# Altium schematic sheet 主板_3.SchDoc
size A4; SheetNumber: 3; SheetTotal: 3
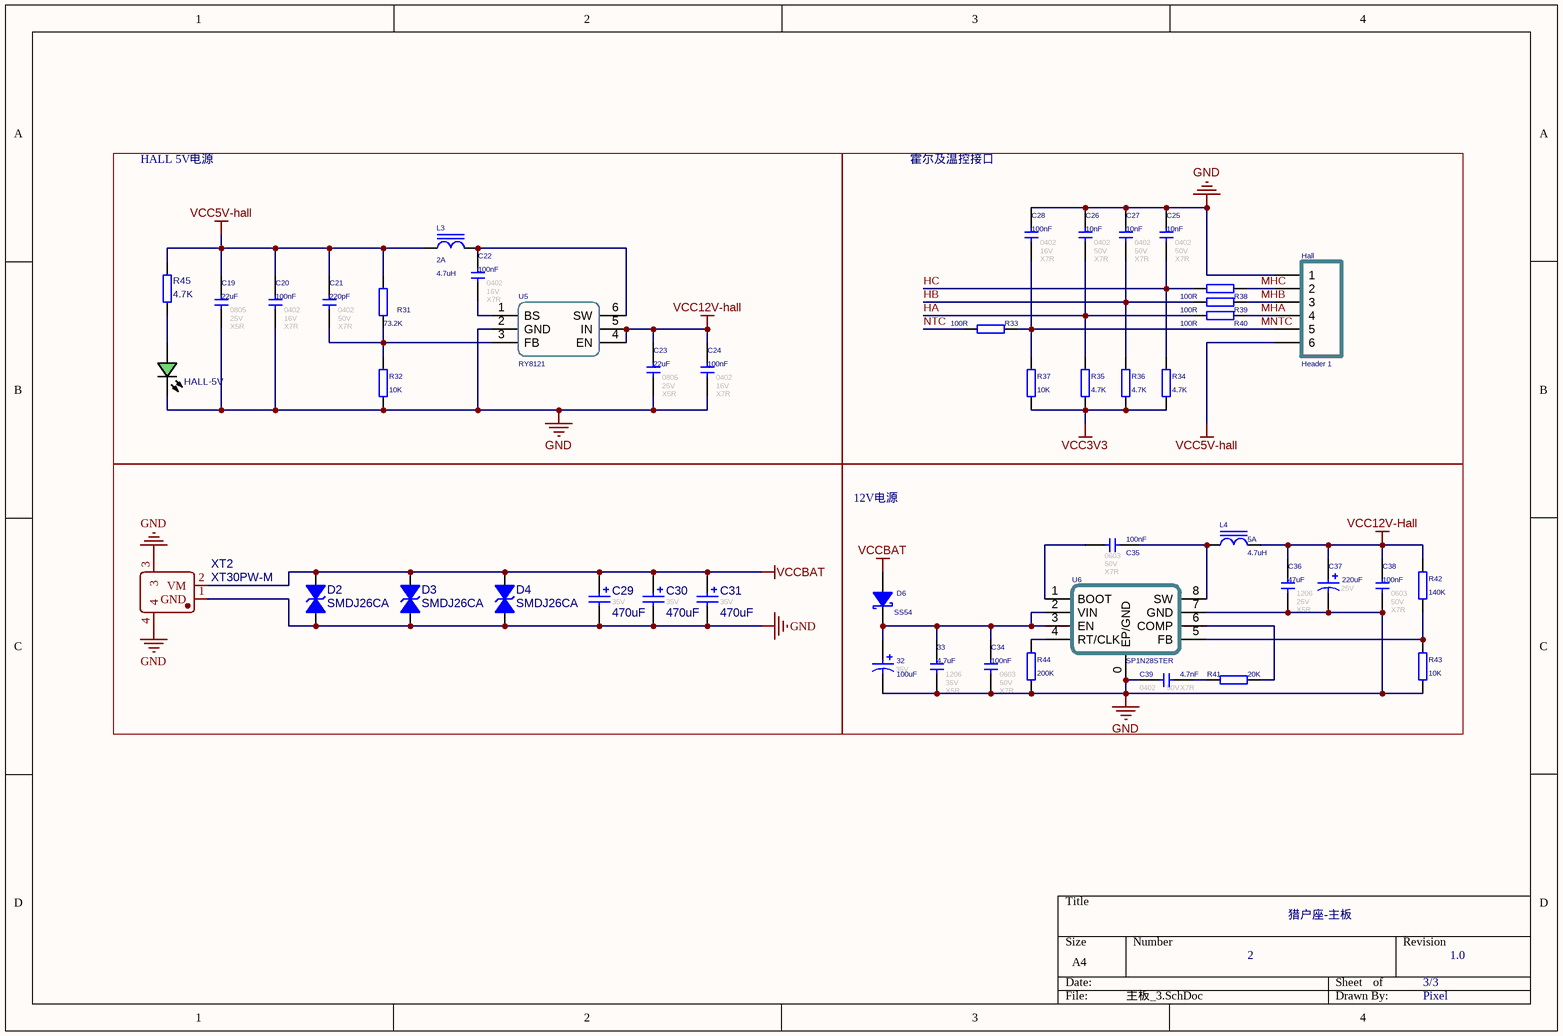
[diagram p0: 主板_3.SchDoc]

## Parts
32  value 100uF  Voltage: 35V  [CAP-E-S 6.3]  (hidden comment: 100uF 35V 铝电解)
33  value 4.7uF  FootPrint: 1206  Voltage: 35V  Type: X5R  [CAPC3216[1206]S]  (hidden comment: 4.7uF 35V X5R)
C19  value 22uF  FootPrint: 0805  Voltage: 25V  Type: X5R  [CAPC2012[0805]S-N]  (hidden comment: 22uF 25V X5R)
C20  value 100nF  FootPrint: 0402  Voltage: 16V  Type: X7R  [CAPC1005[0402]S-N]  (hidden comment: 100nF 16V X7R)
C21  value 220pF  FootPrint: 0402  Voltage: 50V  Type: X7R  [CAPC1005[0402]S-N]  (hidden comment: 220pF 50V X7R)
C22  value 100nF  FootPrint: 0402  Voltage: 16V  Type: X7R  [CAPC1005[0402]S-N]  (hidden comment: 100nF 16V X7R)
C23  value 22uF  FootPrint: 0805  Voltage: 25V  Type: X5R  [CAPC2012[0805]S-N]  (hidden comment: 22uF 25V X5R)
C24  value 100nF  FootPrint: 0402  Voltage: 16V  Type: X7R  [CAPC1005[0402]S-N]  (hidden comment: 100nF 16V X7R)
C25  value 10nF  FootPrint: 0402  Voltage: 50V  Type: X7R  [CAPC1005[0402]S-N]  (hidden comment: 10nF 50V X7R)
C26  value 10nF  FootPrint: 0402  Voltage: 50V  Type: X7R  [CAPC1005[0402]S-N]  (hidden comment: 10nF 50V X7R)
C27  value 10nF  FootPrint: 0402  Voltage: 50V  Type: X7R  [CAPC1005[0402]S-N]  (hidden comment: 10nF 50V X7R)
C28  value 100nF  FootPrint: 0402  Voltage: 16V  Type: X7R  [CAPC1005[0402]S-N]  (hidden comment: 100nF 16V X7R)
C29  value 470uF  Voltage: 35V  [Cap-S-D 3.5-8x14]  (hidden comment: 470uF 35V 聚合物固态)
C30  value 470uF  Voltage: 35V  [Cap-S-D 3.5-8x14]  (hidden comment: 470uF 35V 聚合物固态)
C31  value 470uF  Voltage: 35V  [Cap-S-D 3.5-8x14]  (hidden comment: 470uF 35V 聚合物固态)
C34  value 100nF  FootPrint: 0603  Voltage: 50V  Type: X7R  [CAPC1608[0603]S-N]  (hidden comment: 100nF 50V X7R)
C35  value 100nF  FootPrint: 0603  Voltage: 50V  Type: X7R  [CAPC1608[0603]S-N]  (hidden comment: 100nF 50V X7R)
C36  value 47uF  FootPrint: 1206  Voltage: 25V  Type: X5R  [CAPC3216[1206]S]  (hidden comment: 47uF 25V X5R)
C37  value 220uF  Voltage: 25V  [CAP-E-S 6.3]  (hidden comment: 220uF 25V 铝电解)
C38  value 100nF  FootPrint: 0603  Voltage: 50V  Type: X7R  [CAPC1608[0603]S-N]  (hidden comment: 100nF 50V X7R)
C39  value 4.7nF  FootPrint: 0402  Voltage: 50V  Type: X7R  [CAPC1005[0402]S-N]  (hidden comment: 4.7nF 50V X7R)
D2  SMDJ26CA  [SMC[DO-214AB]-Bi]
D3  SMDJ26CA  [SMC[DO-214AB]-Bi]
D4  SMDJ26CA  [SMC[DO-214AB]-Bi]
D6  SS54  [SMA-L[DO-214AC]]
Hall  Header 1  [ZH1.5-6P-SH]
HALL-5V  翠绿贴片LED  [LEDC1608(0603)-L]  (value not drawn)
L3  value 4.7uH  Imax: 2A  [SLO2520]  (hidden comment: 4.7uH 2A)
L4  value 4.7uH  Imax: 5A  [SLO2520]  (hidden comment: 4.7uH 5A)
R31  value 73.2K  [RESC1005[0402]S-N]  (hidden comment: 73.2K ±1%)
R32  value 10K  [RESC1005[0402]S-N]  (hidden comment: 10K ±1%)
R33  value 100R  [RESC1005[0402]S-N]  (hidden comment: 100R ±1%)
R34  value 4.7K  [RESC1005[0402]S-N]  (hidden comment: 4.7K ±1%)
R35  value 4.7K  [RESC1005[0402]S-N]  (hidden comment: 4.7K ±1%)
R36  value 4.7K  [RESC1005[0402]S-N]  (hidden comment: 4.7K ±1%)
R37  value 10K  [RESC1005[0402]S-N]  (hidden comment: 10K ±1%)
R38  value 100R  [RESC1005[0402]S-N]  (hidden comment: 100R ±1%)
R39  value 100R  [RESC1005[0402]S-N]  (hidden comment: 100R ±1%)
R40  value 100R  [RESC1005[0402]S-N]  (hidden comment: 100R ±1%)
R41  value 20K  [RESC1005[0402]S-N]  (hidden comment: 20K ±1%)
R42  value 140K  [RESC1005[0402]S-N]  (hidden comment: 140K ±1%)
R43  value 10K  [RESC1005[0402]S-N]  (hidden comment: 10K ±1%)
R44  value 200K  [RESC1005[0402]S-N]  (hidden comment: 200K ±1%)
R45  value 4.7K  [RESC1608[0603]S-N]  (hidden comment: 4.7K ±1%)
U5  RY8121  [SOT-23-6]
U6  SP1N28STER  [SOP-8E]
XT2  XT30PW-M  [XT30PW-M]

## Blocks framed on the sheet
HALL 5V电源: C19-C24 HALL-5V L3 R31 R32 R45 U5
霍尔及温控接口: C25-C28 Hall R33-R40
12V电源: 32 33 C34-C39 D6 L4 R41-R44 U6

## Nets
GND: 32.2 33.1 C19.1 C20.1 C23.1 C24.1 C25.2 C26.2 C27.2 C28.2 C29.2 C30.2 C31.2 C34.1 C36.1 C37.2 C38.1 C39.1 D2.A D3.A D4.A Hall.1 HALL-5V.C R32.1 R43.1 R44.1 U5.2(GND) U6.0(EP/GND) U6.7(GND) XT2.1(GND) XT2.3 XT2.4
VCC3V3: R34.1 R35.1 R36.1 R37.1
VCC5V-hall: C19.2 C20.2 C21.2 Hall.6 L3.1 R31.2 R45.2
VCC12V-hall: C23.2 C24.2 C36.2 C37.1 C38.2 L4.2 R42.2 U5.4(EN) U5.5(IN)
VCCBAT: C29.1 C30.1 C31.1 D2.K D3.K D4.K D6.A XT2.2(VM)
HA: C26.1 R35.2 R40.1
HB: C27.1 R36.2 R39.1
HC: C25.1 R34.2 R38.1
MHA: Hall.4 R40.2
MHB: Hall.3 R39.2
MHC: Hall.2 R38.2
MNTC: C28.1 Hall.5 R33.2 R37.2
NTC: R33.1
Net32_1: 32.1 33.2 C34.2 D6.K U6.2(VIN) U6.3(EN)
NetC21_1: C21.1 R31.1 R32.2 U5.3(FB)
NetC22_1: C22.1 U5.1(BS)
NetC22_2: C22.2 L3.2 U5.6(SW)
NetC35_1: C35.1 U6.1(BOOT)
NetC35_2: C35.2 L4.1 U6.8(SW)
NetC39_2: C39.2 R41.1
NetHALL-5V_A: HALL-5V.A R45.1
NetR41_2: R41.2 U6.6(COMP)
NetR42_1: R42.1 R43.2 U6.5(FB)
NetR44_2: R44.2 U6.4(RT/CLK)

## Notes on the sheet
- 猎户座-主板
- 2
- 3/3
- 1.0
- Pixel

## Library data of the parts
32 = E-S 100uF 35V 6.3x7.7: 贴片电解电容 100uF 35V 6.3x7.7; Revision: V1.0; Type: 铝电解
33 = 4.7uF 1206 35V X5R: 贴片瓷片电容; MLCC; 1206(3216);; Revision: V1.0
C19 C23 = 22uF 0805 25V X5R: 贴片瓷片电容; MLCC; 0805(2012);; Revision: V1.0
C20 C22 C24 C28 = 100nF 0402 16V X7R: 贴片瓷片电容; MLCC; 0402(1005);; Revision: V1.0
C21 = 220pF 0402 50V X7R: 贴片瓷片电容; MLCC; 0402(1005);; Revision: V1.0
C25-C27 = 10nF 0402 50V X7R: 贴片瓷片电容; MLCC; 0402(1005);; Revision: V1.0
C29-C31 = S-D 470uF 35V 8x14: 直插固态电容 470uF 35V 8x14; Revision: V1.0; Type: 聚合物固态
C34 C35 C38 = 100nF 0603 50V X7R: 贴片瓷片电容; MLCC; 0603(1608);; Revision: V1.0
C36 = 47uF 1206 25V X5R: 贴片瓷片电容; MLCC; 1206(3216);; Revision: V1.0
C37 = E-S 220uF 25V 6.3x7.7: 贴片电解电容 220uF 25V 6.3x7.7; Revision: V1.0; Type: 铝电解
C39 = 4.7nF 0402 50V X7R: 贴片瓷片电容; MLCC; 0402(1005);; Revision: V1.0
D2-D4 = Diode TVS Bi-Dir: TRANSIENT VOLTAGE  SUPPRESSOR DIODE; Imax: 500mA; Published: 8-Jun-2000; Publisher: Altium Limited; Price(RMB): 0.000
D6 = SS54: SS54 肖特基二极管; Revision: V1.0; Value: SS54
Hall = Header 6: Header, 6-Pin; LatestRevisionDate: 17-Jul-2002; LatestRevisionNote: Re-released for DXP Platform.; Publisher: Altium Limited; Price(RMB): 0.00
HALL-5V = LED Chip Green: Published: 8-Jun-2000; Revision: July-2002: Re-released for DXP Platform.; Publisher: Altium Limited; Price(RMB): 0.00
L3 L4 = Ind-Power: 功率电感; DCR: .5m; Published: 8-Jun-2000; Revision: July-2002: Re-released for DXP Platform.; Publisher: Altium Limited; Price(RMB): 0.000
R31 = Res-Chip_8: 贴片电阻; Power: 1/8W; Revision: V1.0; Tolerance: ±1%
R32 R37 R43 = Res-Chip_1: 贴片电阻; Power: 1/8W; Revision: V1.0; Tolerance: ±1%
R33 R38-R40 = Res-Chip_5: 贴片电阻; Power: 1/8W; Revision: V1.0; Tolerance: ±1%
R34-R36 = Res-Chip_4: 贴片电阻; Power: 1/8W; Revision: V1.0; Tolerance: ±1%
R41 = Res-Chip_7: 贴片电阻; Power: 1/8W; Revision: V1.0; Tolerance: ±1%
R42 = Res-Chip_11: 贴片电阻; Power: 1/8W; Revision: V1.0; Tolerance: ±1%
R44 = Res-Chip_10: 贴片电阻; Power: 1/8W; Revision: V1.0; Tolerance: ±1%
R45 = Res-Chip_3: 贴片电阻; Power: 1/8W; Revision: V1.0; Tolerance: ±1%
U5 = RY8121: 18V 2A 1MHz Synchronous Step-Down Regulator
XT2 = XT30PW-M: System: Connector
U6 = SP1N28STER: Revision: V1.0; Value: SP1N28STER